# EAGLE design Nintendo 2DS USB-C (EAGLE 6.2)
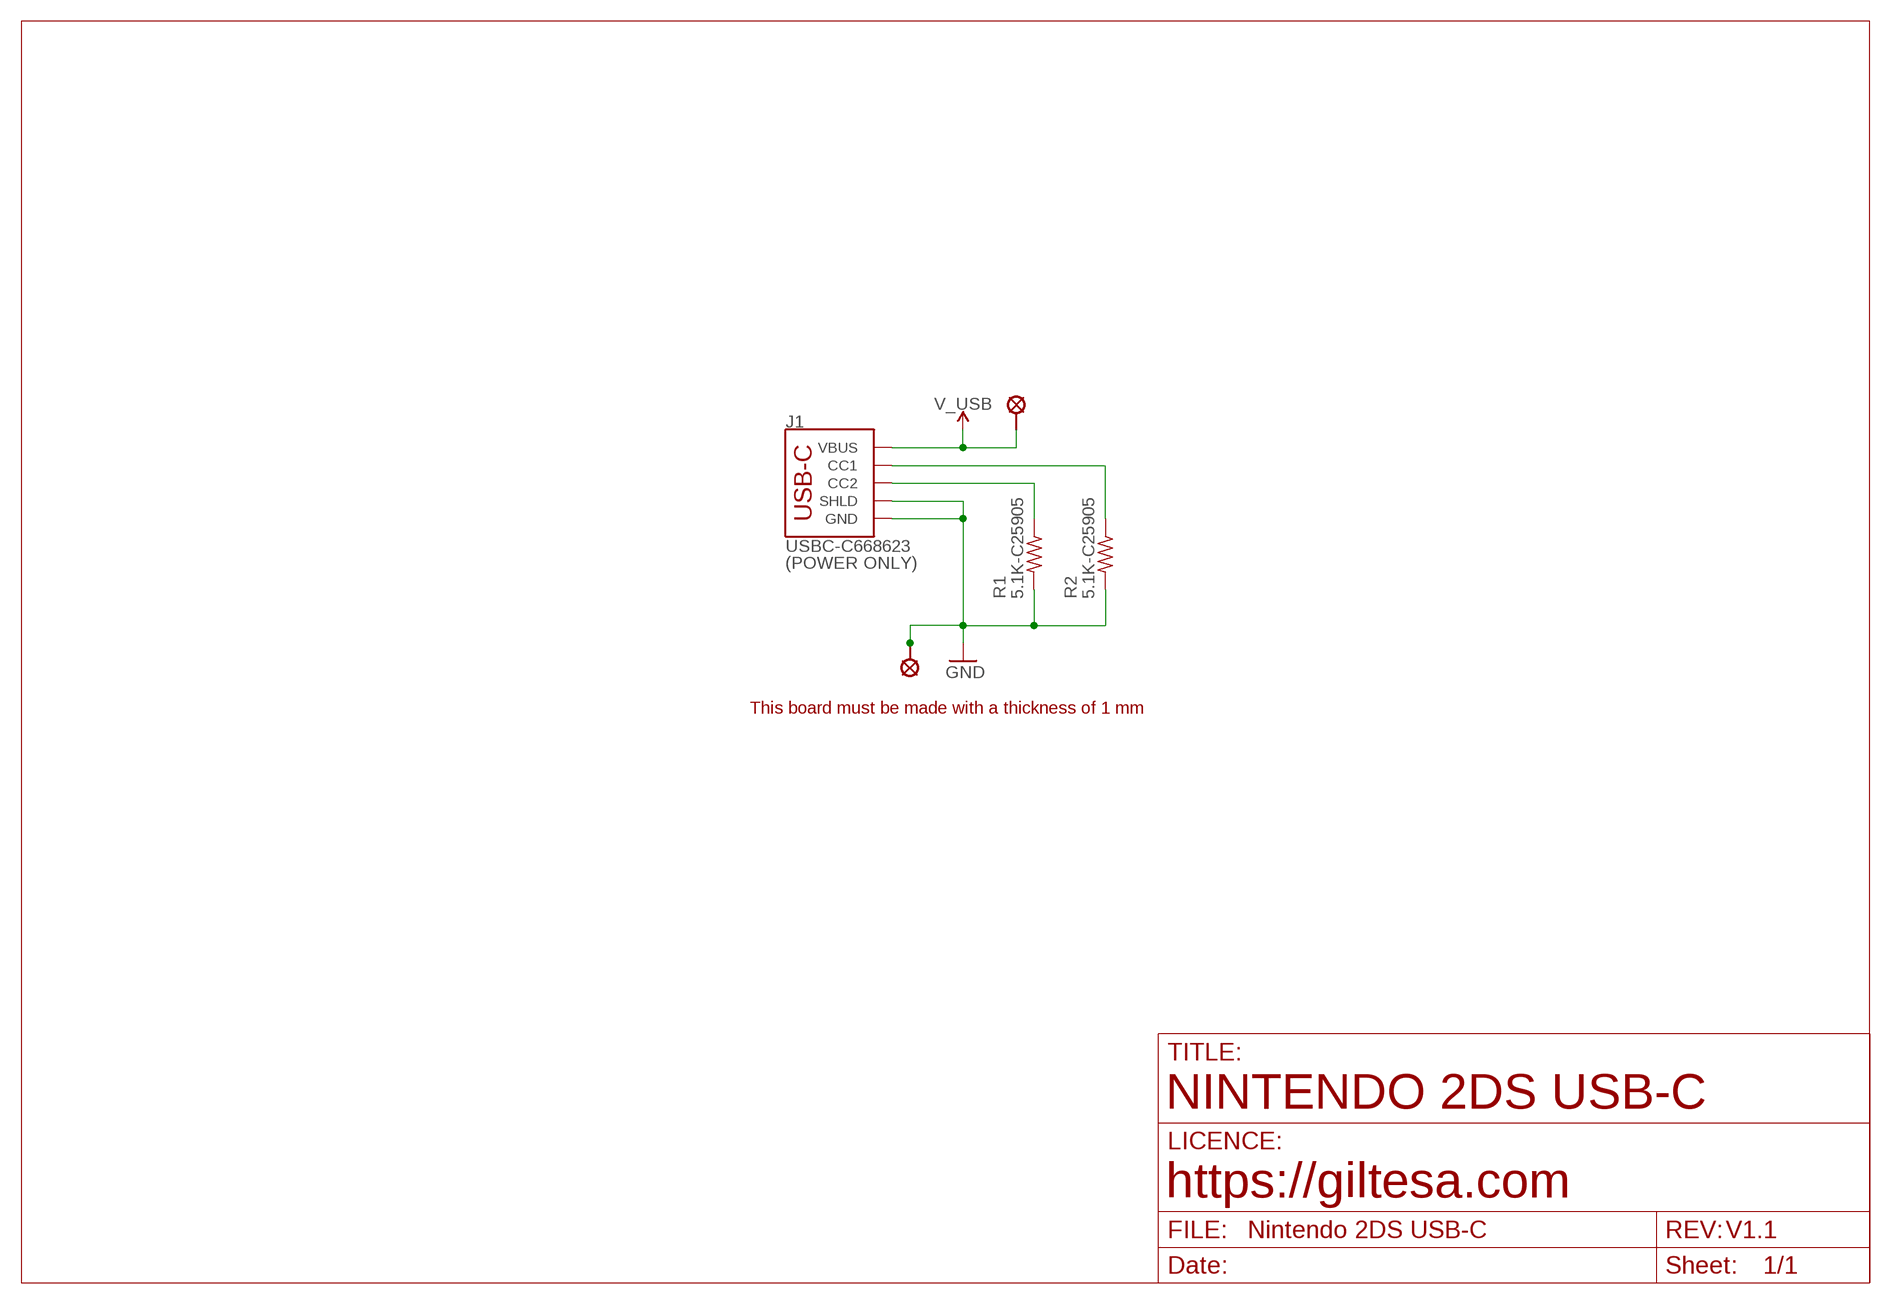
[diagram p0: schematic, sheet 1]

## Parts
J1  USBC-C668623  USB-CPOWER  [USB-C_6P]
R1  5.1K-C25905  R0402  [R0402]
R2  5.1K-C25905  R0402  [R0402]
U$2  PAD_1.0H  [PAD_1.0_HALF_MASK]
U$3  PAD_1.0H  [PAD_1.0_HALF_MASK]
U$4  PAD_1.0H  [PAD_1.0_HALF_MASK]
U$5  PAD_1.0H  [PAD_1.0_HALF_MASK]

## Nets
GND: J1.GND1(GND) J1.GND2(GND) J1.SHLD1(SHLD) J1.SHLD2(SHLD) J1.SHLD3(SHLD) J1.SHLD4(SHLD) J1.SHLD5(SHLD) J1.SHLD6(SHLD) J1.SHLD7(SHLD) J1.SHLD8(SHLD) R1.2 R2.2 U$3.P$1 U$4.P$1 U$5.P$1
N$4: J1.B5(CC2) R1.1
N$13: J1.A5(CC1) R2.1
V_USB: J1.VBUS1(VBUS) J1.VBUS2(VBUS) U$2.P$1

## Notes on the sheet
- (POWER ONLY)
- This board must be made with a thickness of 1 mm
- NINTENDO 2DS USB-C
- https://giltesa.com
- V1.1

## Library data of the parts
J1 = ,giltesa:USB-C
R1 R2 = ,giltesa:R0402
U$2-U$5 = ,giltesa:PAD

## Net classes
1 power: width 0.61 mm, drill 0.406 mm, clearance 0.203 mm
2 gnd: width 0.305 mm, drill 0.406 mm, clearance 0.203 mm
3 power usb: width 0.508 mm, drill 0.406 mm, clearance 0.203 mm

## Board
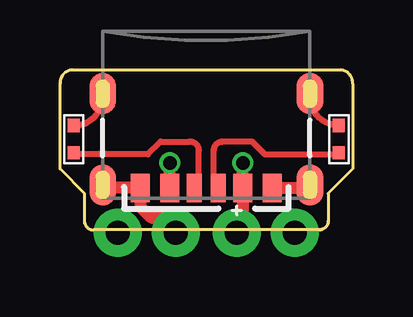
[diagram p1: board, top side]
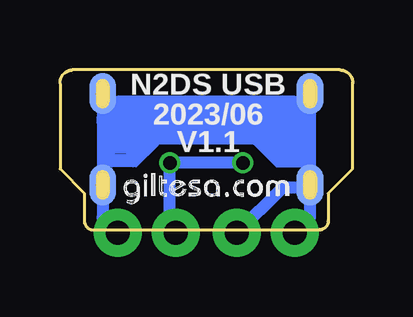
[diagram p2: board, bottom side, seen from below]

Size 12.19 x 6.67 mm. Coordinates in mm from the lower left corner, seen from the top.
Outline: 12.19,6.1 12.19,2.54 11.18,1.52 11.18,0.38 arc-90 10.8,0 1.4,0 arc-90 1.02,0.38 1.02,1.52 0,2.54 0,6.1 arc-90 0.51,6.67 11.68,6.67 arc-90 12.19,6.1
Copper layers (1*16): Top 0.035mm / dielectric 1.6mm / Bottom 0.035mm
Design rules: minimum track width 6mil, minimum drill 12mil, track to track 6mil, track to pad 6mil, pad to pad 6mil, via to via 8mil, smd to smd 0mil, copper to edge 20mil, drill to drill 10mil, minimum pad ring 6mil, minimum via ring 6mil, stop-mask expansion 0mil, vias tented up to drill 100mil, thermal gap 10mil

### Footprints (pad centres in the part's own frame; a part is rotated, then mirrored left to right if it is on the bottom)
USB-C_6P = smd 0.635 x 1.2: A5 -0.5,-0.017; B5 0.5,-0.017 | smd 0.8 x 1.2: GND1 -2.75,-0.017; GND2 2.75,-0.017; VBUS1 -1.52,-0.017; VBUS2 1.52,-0.017 | smd 1.1 x 1.7: SHLD1 -4.32,-0.15; SHLD2 4.32,-0.15; SHLD5 -4.32,-3.95; SHLD8 4.32,-3.95 | smd 1.1 x 1.7 bottom: SHLD3 -4.32,-0.15; SHLD4 4.32,-0.15; SHLD6 -4.32,-3.95; SHLD7 4.32,-3.95
R0402 = smd 0.559 x 0.5: 1 -0.567,0; 2 0.567,0
PAD_1.0_HALF_MASK = drill 1 pad 2: P$1 0,0

### Placement (x,y rotation side)
J1  6.1,1.73 180 top
R1  0.57,3.78 90 top
R2  11.62,3.78 90 top
U$1  [N2DS]  6.1,0 0 top
U$2  7.37,-0.13 0 top
U$3  2.41,-0.13 0 top
U$4  4.83,-0.13 0 top
U$5  9.78,-0.13 0 top
U$11  [GILTESA.COM_MASK_7MM]  9.58,1.02 0 bottom

### Tracks (layer width: path | path; a pad name or v marks a point on that pad's centre or on a via)
GND  (3 unrouted)
  Top 0.254: R1.2 arc90 1.78,5.55 J1.SHLD8 | R2.2 arc-90 10.42,5.55 J1.SHLD5
  Top 0.508: J1.SHLD4 1.91,1.75 J1.GND2 3.35,0.97 3.81,0.51 4.19,0.51 U$4.P$1 | J1.GND1 10.28,1.75 J1.SHLD1
  Bottom 0.508: J1.SHLD4 J1.SHLD8 1.78,4.96 2.54,4.57 | J1.SHLD5 10.42,5.08 | 10.42,5.08 J1.SHLD1 10.42,0.51 U$5.P$1 | J1.SHLD4 1.78,0.51 U$3.P$1 | 9.65,4.57 10.42,5.08 | J1.SHLD4 1.88,1.78 2.92,1.78 U$4.P$1
  Bottom 2.032: 2.54,4.57 9.65,4.57
N$1
  Bottom 0.254: 1.91,2.79 2.92,2.79 3.68,3.56 2.16,3.56 2.03,3.68 2.03,2.92 2.79,2.92 3.3,3.43 2.16,3.43 2.16,3.05 2.79,3.05 2.79,3.17 2.92,3.3 2.29,3.3
N$2
  Bottom 0.254: 10.16,2.79 9.14,2.79 8.38,3.56 10.16,3.56 10.16,2.92 9.27,2.92 8.76,3.43 10.03,3.43 10.03,3.05 9.4,3.05 9.14,3.3 9.91,3.3
N$3
  Bottom 0.127: 3.05,2.67 3.18,2.67 4.06,3.56 | 3.05,2.67 2.92,2.67 | 2.92,2.67 2.03,2.67 | 3.05,2.67 3.94,3.56 | 2.92,2.67 3.81,3.56
N$4
  Top 0.254: J1.B5 5.6,1.91 5.79,2.03 5.79,3.3 arc90 5.41,3.68 4.19,3.68 3.66,3.15 0.63,3.15 R1.1
N$5
  Bottom 0.127: 10.03,2.67 9.14,2.67 8.26,3.56 | 10.03,2.67 10.16,2.67 | 8.13,3.56 9.02,2.67 10.03,2.67
N$13
  Top 0.254: J1.A5 6.6,1.79 6.41,1.91 6.41,3.3 arc-90 6.79,3.68 8,3.68 8.53,3.15 11.56,3.15 R2.1
V_USB  (via drill 0.56)
  Top 0.508: v7.62,2.79 J1.VBUS1 7.62,0.12 U$2.P$1 | J1.VBUS2 v4.58,2.79
  Bottom 0.508: U$2.P$1 7.62,0.13 v7.62,2.79 v4.58,2.79

### Text on the board
bPlace: N2DS USB | 2023/06 | V1.1